# EAGLE schematic main (EAGLE 7.1.0)
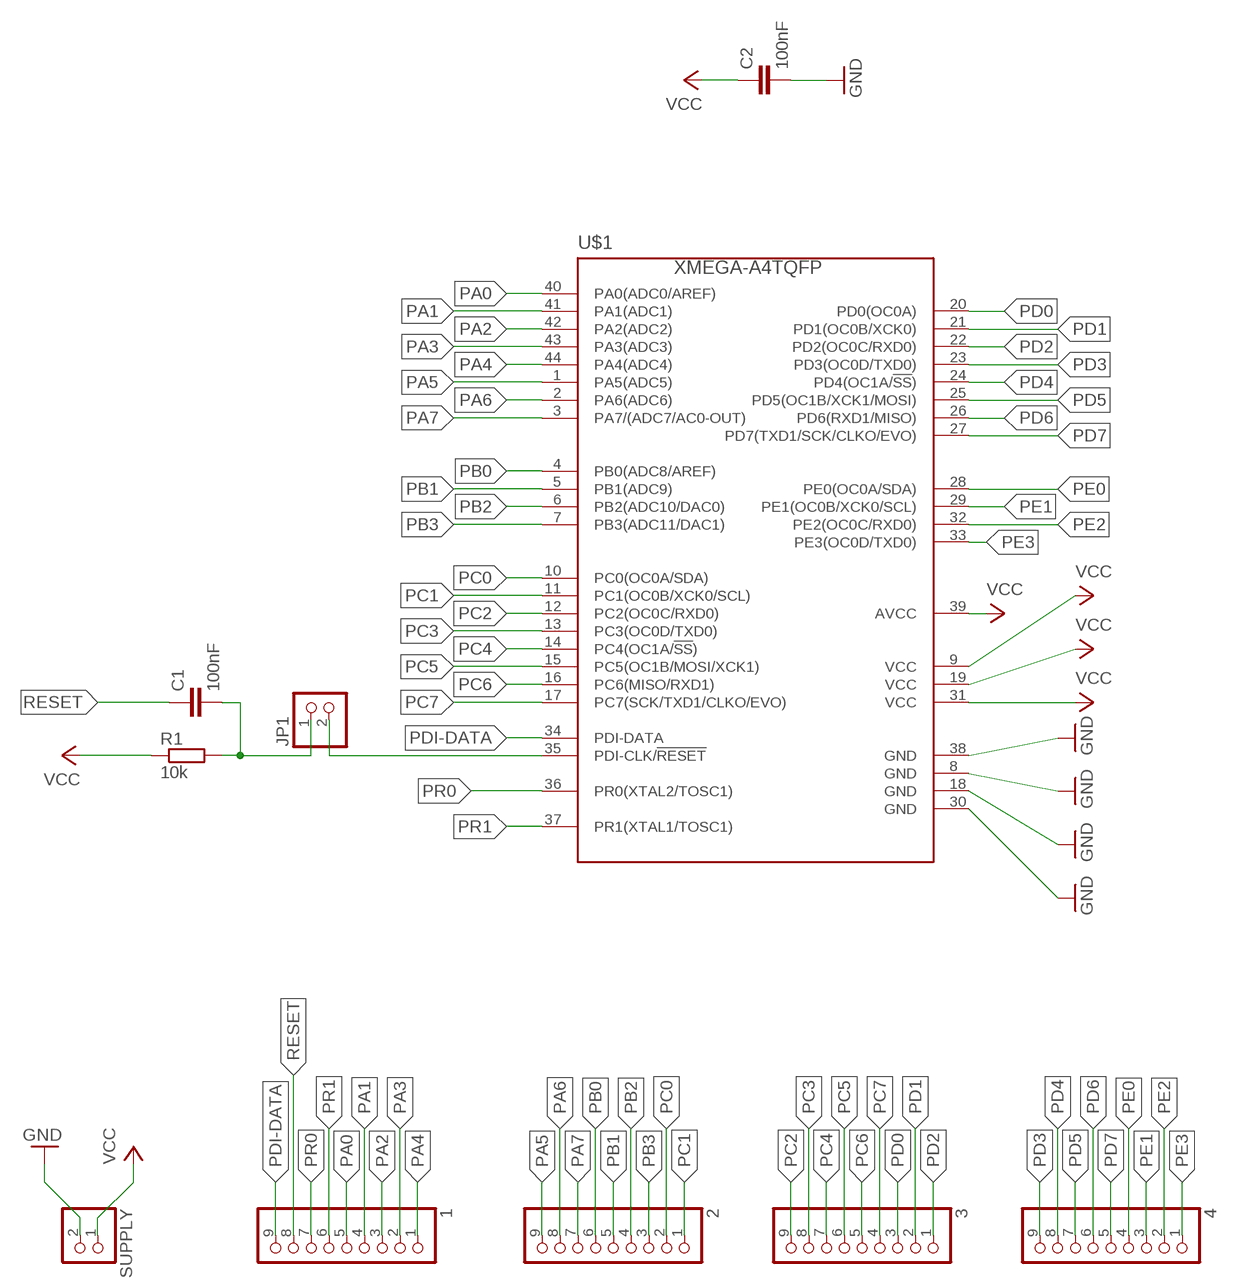
[diagram p0: schematic, sheet 1]

## Parts
1  PINHD-1X9  [1X09]
2  PINHD-1X9  [1X09]
3  PINHD-1X9  [1X09]
4  PINHD-1X9  [1X09]
C1  100nF  CC0201  [C0201]
C2  100nF  CC0201  [C0201]
JP1  PINHD-1X2  [1X02]
R1  10k  RR1206  [R1206]
SUPPLY  PINHD-1X2  [1X02]
U$1  XMEGA-A4TQFP  [TQFP44]

## Nets
GND: C2.2 SUPPLY.2 U$1.8(GND) U$1.18(GND) U$1.30(GND) U$1.38(GND)
N$1: JP1.2 U$1.35(PDI-CLK/!RESET)
N$9: C1.2 JP1.1 R1.2
PA0: 1.5 U$1.40(PA0(ADC0/AREF))
PA1: 1.4 U$1.41(PA1(ADC1))
PA2: 1.3 U$1.42(PA2(ADC2))
PA3: 1.2 U$1.43(PA3(ADC3))
PA4: 1.1 U$1.44(PA4(ADC4))
PA5: 2.9 U$1.1(PA5(ADC5))
PA6: 2.8 U$1.2(PA6(ADC6))
PA7: 2.7 U$1.3(PA7/(ADC7/AC0-OUT))
PB0: 2.6 U$1.4(PB0(ADC8/AREF))
PB1: 2.5 U$1.5(PB1(ADC9))
PB2: 2.4 U$1.6(PB2(ADC10/DAC0))
PB3: 2.3 U$1.7(PB3(ADC11/DAC1))
PC0: 2.2 U$1.10(PC0(OC0A/SDA))
PC1: 2.1 U$1.11(PC1(OC0B/XCK0/SCL))
PC2: 3.9 U$1.12(PC2(OC0C/RXD0))
PC3: 3.8 U$1.13(PC3(OC0D/TXD0))
PC4: 3.7 U$1.14(PC4(OC1A/!SS!))
PC5: 3.6 U$1.15(PC5(OC1B/MOSI/XCK1))
PC6: 3.5 U$1.16(PC6(MISO/RXD1))
PC7: 3.4 U$1.17(PC7(SCK/TXD1/CLKO/EVO))
PD0: 3.3 U$1.20(PD0(OC0A))
PD1: 3.2 U$1.21(PD1(OC0B/XCK0))
PD2: 3.1 U$1.22(PD2(OC0C/RXD0))
PD3: 4.9 U$1.23(PD3(OC0D/TXD0))
PD4: 4.8 U$1.24(PD4(OC1A/!SS!))
PD5: 4.7 U$1.25(PD5(OC1B/XCK1/MOSI))
PD6: 4.6 U$1.26(PD6(RXD1/MISO))
PD7: 4.5 U$1.27(PD7(TXD1/SCK/CLKO/EVO))
PDI-DATA: 1.9 U$1.34(PDI-DATA)
PE0: 4.4 U$1.28(PE0(OC0A/SDA))
PE1: 4.3 U$1.29(PE1(OC0B/XCK0/SCL))
PE2: 4.2 U$1.32(PE2(OC0C/RXD0))
PE3: 4.1 U$1.33(PE3(OC0D/TXD0))
PR0: 1.7 U$1.36(PR0(XTAL2/TOSC1))
PR1: 1.6 U$1.37(PR1(XTAL1/TOSC1))
RESET: 1.8 C1.1
VCC: C2.1 R1.1 SUPPLY.1 U$1.9(VCC) U$1.19(VCC) U$1.31(VCC) U$1.39(AVCC)

## Library data of the parts
1-4 = pinhead:PINHD-1X9: PIN HEADER
C1 C2 = eagle-ltspice:C: CAPACITOR, European symbol; SPICEMODEL: NONE; SPICEPREFIX: C
JP1 SUPPLY = pinhead:PINHD-1X2: PIN HEADER
R1 = eagle-ltspice:R: RESISTOR, European symbol; SPICEMODEL: NONE; SPICEPREFIX: R
U$1 = avr-7:XMEGA-A4: Atmel XMega A4 series processor